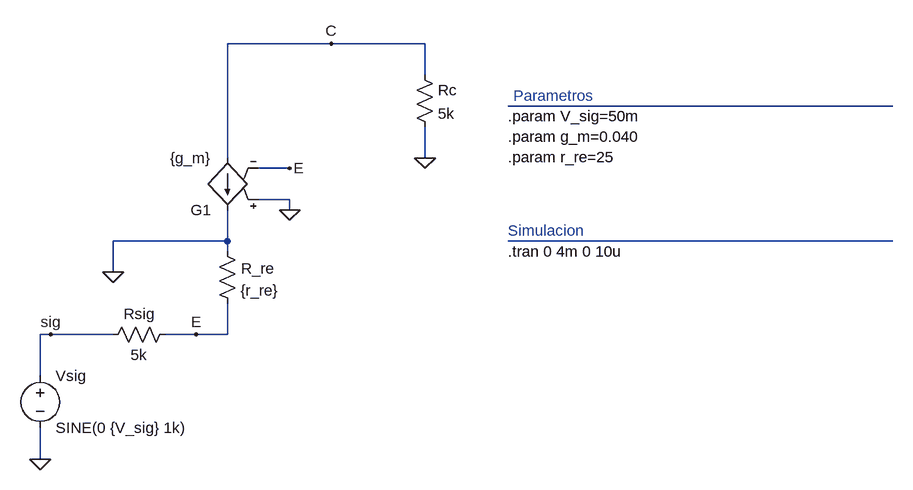
[diagram p0: schematic BC_ejemplo1_parte1.asc]
BC_ejemplo1_parte1.asc, the LTspice schematic file:
Version 4
SHEET 1 1220 680
WIRE -16 -208 -176 -208
WIRE 128 -208 -16 -208
WIRE 128 -160 128 -208
WIRE 848 -112 256 -112
WIRE -176 -32 -176 -208
WIRE 128 -32 128 -80
WIRE -80 -16 -128 -16
WIRE -80 32 -128 32
WIRE -80 48 -80 32
WIRE -176 96 -176 48
WIRE -176 96 -352 96
WIRE 848 96 256 96
WIRE -176 112 -176 96
WIRE -352 144 -352 96
WIRE -448 240 -464 240
WIRE -352 240 -448 240
WIRE -224 240 -272 240
WIRE -176 240 -176 192
WIRE -176 240 -224 240
WIRE -464 304 -464 240
WIRE -464 432 -464 384
FLAG -464 432 0
FLAG 128 -32 0
FLAG -448 240 sig
FLAG -16 -208 C
FLAG -352 144 0
FLAG -224 240 E
FLAG -80 -16 E
FLAG -80 48 0
SYMBOL voltage -464 288 R0
WINDOW 123 0 0 Left 0
WINDOW 39 0 0 Left 0
SYMATTR InstName Vsig
SYMATTR Value SINE(0 {V_sig} 1k)
SYMBOL res -192 96 R0
WINDOW 0 37 42 Left 2
SYMATTR InstName R_re
SYMATTR Value {r_re}
SYMBOL res 112 -176 R0
SYMATTR InstName Rc
SYMATTR Value 5k
SYMBOL res -368 256 R270
WINDOW 0 32 56 VTop 2
WINDOW 3 0 56 VBottom 2
SYMATTR InstName Rsig
SYMATTR Value 5k
SYMBOL g -176 64 R180
SYMATTR InstName G1
SYMATTR Value {g_m}
TEXT 256 -96 Left 2 !.param V_sig=50m\n.param g_m=0.040\n.param r_re=25
TEXT 256 112 Left 2 !.tran 0 4m 0 10u
TEXT 264 -128 Left 2 ;Parametros
TEXT 256 80 Left 2 ;Simulacion

The netlist it stands for:
* BC_ejemplo1_parte1.asc
Vsig sig 0 SINE(0 {V_sig} 1k)
R_re 0 E {r_re}
Rc C 0 5k
Rsig sig E 5k
G1 C 0 0 E {g_m}
.param V_sig=50m
.param g_m=0.040
.param r_re=25
.tran 0 4m 0 10u
* Parametros
* Simulacion
.backanno
.end